# Altium schematic sheet RAIL_DISCHARGE.SchDoc
size A4; SheetNumber: 4; SheetTotal: 19
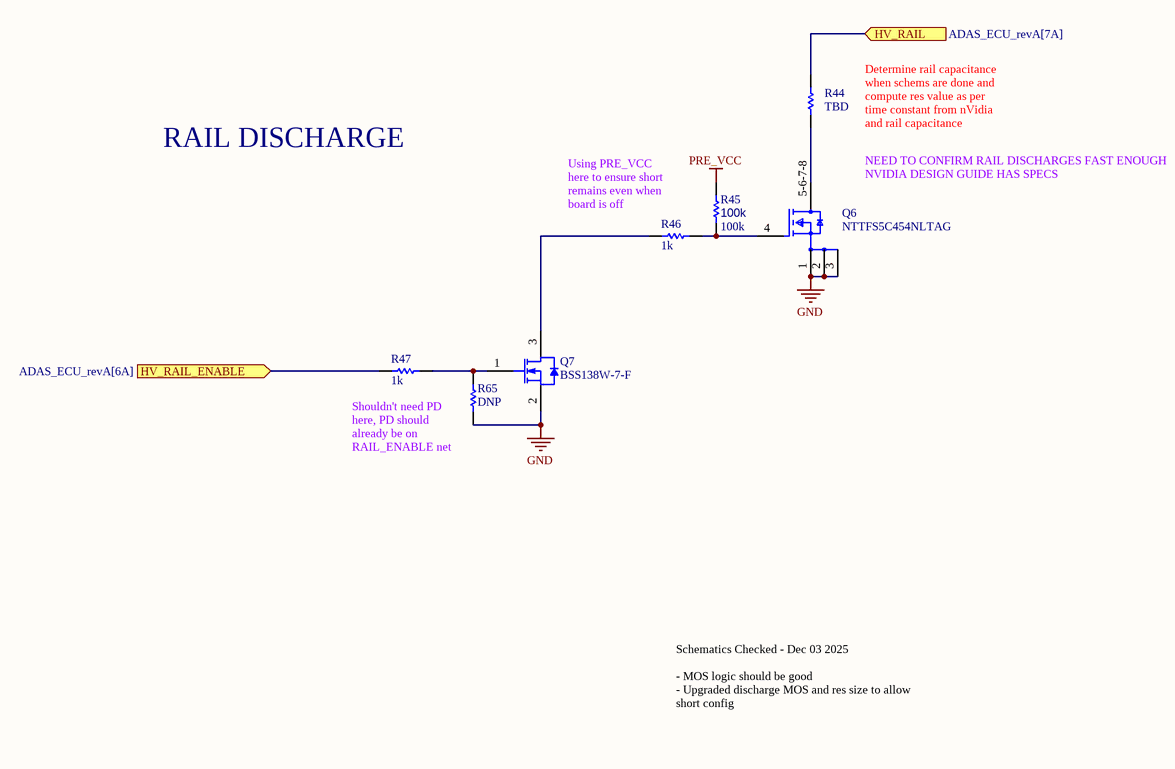
[diagram p0: RAIL_DISCHARGE.SchDoc]

## Parts
Q6  NTTFS5C454NLTAG  [FP-511AB-MFG]
Q7  BSS138W-7-F  [DIOD-SOT323-3_V]
R44  TBD  [R1206B]
R45  100k  [R0603B]
R46  1k  [R0603B]
R47  1k  [R0603B]
R65  DNP  [R0603B]

## Ports
HV_RAIL (in, see ADAS_ECU_revA[7A]), HV_RAIL_ENABLE (in, see ADAS_ECU_revA[6A])

## Nets
GND: Q6.1(S) Q6.2(S) Q6.3(S) Q7.2(S) R65.2
PRE_VCC: R45.2
HV_RAIL: R44.1 ; port HV_RAIL
HV_RAIL_ENABLE: R47.2 ; port HV_RAIL_ENABLE
NetQ6_4: Q6.4(G) R45.1 R46.2
NetQ6_5-6-7-8: Q6.5-6-7-8(D) R44.2
NetQ7_1: Q7.1(G) R47.1 R65.1
NetQ7_3: Q7.3(D) R46.1

## Notes on the sheet
- Determine rail capacitance when schems are done and compute res value as per time constant from nVidia and rail capacitance
- RAIL DISCHARGE
- NEED TO CONFIRM RAIL DISCHARGES FAST ENOUGH
- (near Q6) NVIDIA DESIGN GUIDE HAS SPECS
- Using PRE_VCC here to ensure short remains even when board is off
- (near R65) Shouldn't need PD here, PD should already be on RAIL_ENABLE net
- Schematics Checked - Dec 03 2025
  - MOS logic should be good
  - Upgraded discharge MOS and res size to allow short config

## Library data of the parts
Q6 = CMP-00278-71475164-1: NTTFS5C454NLTAG Single N-Channel Power MOSFET 40V, 85A, 3.8mΩ Power MOSFET 40V, 85A, 3.8 mOhm, Single N-Channel, u8FL, Logic Level; Manufacturer Lifecycle Status: ACTIVE; Max Power Dissipation: 3.2W; Turn-On Delay Time: 9.3ns; Turn-Off Delay Time: 17ns; Gate to Source Voltage (Vgs): 20V; Continuous Drain Current (ID): 20A; Drain to Source Resistance: 4.8mΩ; Max Junction Temperature (Tj): 175°C; Input Capacitance: 1.6nF; Number of Channels: 1; Threshold Voltage: 2V; Lead Free: Lead Free; Drain to Source Voltage (Vdss): 40V; Schedule B: 8541290080; Number of Pins: 8; Mount: Surface Mount; Power Dissipation: 3.2W; Min Operating Temperature: -55°C; RoHS: Compliant; Drain to Source Breakdown Voltage: 40V; Max Operating Temperature: 175°C; Height: 800µm; Lifecycle Status: Production; NexarPartId: 71475164; REACH SVHC: No SVHC; Rds On Max: 3.8mΩ
Q7 = CMP-2000-05968-1: N-Channel Enhancement Mode Mosfet, 50 V, 200 mA, -55 to 150 degC, 6-Pin SOT-323, RoHS, Tape and Reel; Typical Turn-Off Delay Time: 20ns; Number of Channels: 1Channel; Type: EnhancementModeFieldEffectTransistor; Brand: DiodesIncorporated; Vds - Drain-Source Breakdown Voltage: 75V; Vgs - Gate-Source Voltage: 20V; Rds On - Drain-Source Resistance: 1.4Ohms; Transistor Type: 1N-Channel; Configuration: Single; Unit Weight: 0.000212oz; Pd - Power Dissipation: 200mW; Id - Continuous Drain Current: 200mA; Forward Transconductance - Min: 0.1S; Manufacturer URL: http://www.diodes.com/; Series: BSS138; Package Description: 3-Pin Small Outline Transistor, Body 2 x 1.25 mm, Pitch 0.65 mm; Mounting Technology: SurfaceMount; Product Category: MOSFET; RoHS: True; Maximum Operating Temperature: +150C; Height: 1mm; Length: 2.2mm; Technology: Si; Width: 1.35mm; Datasheet URL: http://www.diodes.com/_files/datasheets/ds30206.pdf; Manufacturer: DiodesIncorporated; Package / Case: SOT-323-3; Typical Turn-On Delay Time: 20ns; Transistor Polarity: N-Channel; Factory Pack Quantity: 3000; Packaging: Reel; Product: MOSFETSmallSignal; Datasheet Version: Rev. 11-2, 09/2013; Package Reference: SOT323; Minimum Operating Temperature: -55C; Mounting Style: SMD/SMT; Channel Mode: Enhancement
R44-R47 R65 = CMP-009-00002-14: Resistor
  R44: Value: TBD
  R45: Value: 100k
  R46 R47: Value: 1k
  R65: Value: DNP